# Altium project QuadrotorExpansion.PrjPCB
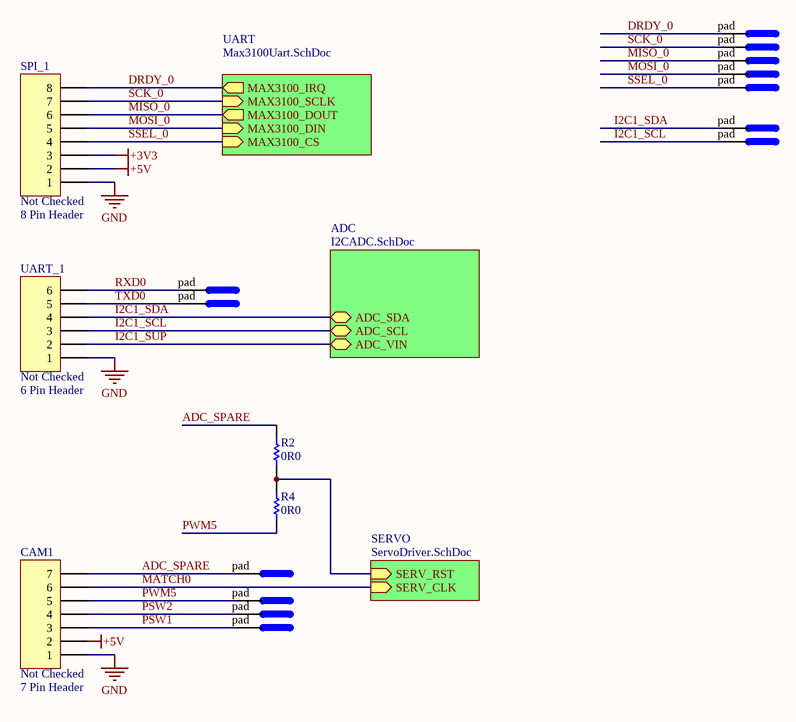
[diagram p0: ExpansionMain.SchDoc]
4 sheets, 65 parts. Net scope: hierarchical (ports join the sheet entries above them; power ports are global).
Board file: PCB5.PcbDoc
Sheets:
  ExpansionMain.SchDoc
    SERVO = ServoDriver.SchDoc
    UART = Max3100Uart.SchDoc
    ADC = I2CADC.SchDoc

## Sheet ExpansionMain.SchDoc
size A; PageSetup: Record=PageOptions|CenterHorizontal=True|CenterVertical=True|PrintScale=1.54|XCorrection=1.00|YCorrection=1.00|PrintKind=1|BorderSize=5000000|LeftOffset=0|BottomOffset=0|Orientation=2|PaperLength=1000|PaperWidth=1000|Scale=100|PaperSource=7|PrintQuality=-4|MediaType=1|DitherType=10|PaperKind=A3|PrintScaleMode=1

### Parts
A0  (no value)  [PAD_ROUND]
CAM1  Verify: Not Checked  [CONN_7X1_SMT_RA_1.25MM]  (hidden comment: 7 Pin Header)
DRDY  (no value)  [PAD_ROUND]
MISO  (no value)  [PAD_ROUND]
MOSI  (no value)  [PAD_ROUND]
PWM  (no value)  [PAD_ROUND]
R2  0R0  [0805]  (no BOM)
R4  0R0  [0805]  (no BOM)
RX0  (no value)  [PAD_ROUND]
SCK  (no value)  [PAD_ROUND]
SCL  (no value)  [PAD_ROUND]
SDA  (no value)  [PAD_ROUND]
SPI_1  Verify: Not Checked  [CONN_8X1_SMT_RA_1.25MM]  (hidden comment: 8 Pin Header)
SSEL  (no value)  [PAD_ROUND]
SW1  (no value)  [PAD_ROUND]
SW2  (no value)  [PAD_ROUND]
TX0  (no value)  [PAD_ROUND]
UART_1  Verify: Not Checked  [CONN_6X1_SMT_RA_1.25MM]  (hidden comment: 6 Pin Header)

### Sub-sheets
ADC = I2CADC.SchDoc: ADC_SCL (bidir), ADC_SDA (bidir), ADC_VIN (bidir)
SERVO = ServoDriver.SchDoc: SERV_CLK (in), SERV_RST (in)
UART = Max3100Uart.SchDoc: MAX3100_DIN (in), MAX3100_CS (in), MAX3100_DOUT (out), MAX3100_SCLK (in), MAX3100_IRQ (out)

### Nets
+3V3: SPI_1.3
+5V: CAM1.2 SPI_1.2
GND: CAM1.1 SPI_1.1 UART_1.1
I2C1_SUP: UART_1.2 ; sheet ADC/ADC_VIN
ADC_SPARE: A0.pad CAM1.7 R2.1
DRDY_0: DRDY.pad SPI_1.8 ; sheet UART/MAX3100_IRQ
I2C1_SCL: SCL.pad UART_1.3 ; sheet ADC/ADC_SCL
I2C1_SDA: SDA.pad UART_1.4 ; sheet ADC/ADC_SDA
MATCH0: CAM1.6 ; sheet SERVO/SERV_CLK
MISO_0: MISO.pad SPI_1.6 ; sheet UART/MAX3100_DOUT
MOSI_0: MOSI.pad SPI_1.5 ; sheet UART/MAX3100_DIN
PSW1: CAM1.3 SW1.pad
PSW2: CAM1.4 SW2.pad
PWM5: CAM1.5 PWM.pad R4.2
RXD0: RX0.pad UART_1.6
SCK_0: SCK.pad SPI_1.7 ; sheet UART/MAX3100_SCLK
SSEL_0: SPI_1.4 SSEL.pad ; sheet UART/MAX3100_CS
TXD0: TX0.pad UART_1.5
NetR2_2: R2.2 R4.1 ; sheet SERVO/SERV_RST

### Library data of the parts
A0 DRDY MISO MOSI PWM RX0 SCK SCL SDA SSEL SW1 SW2 TX0 = JP_pad: Pad; pin to pad: pad>1
CAM1 = JP_7PIN HDR_SMT_RA_MOLEX: CONN HDR VERT 7POS .100" SNGL; Manufacturer: Molex; Manufacturer PN: 53261-0771; Prototype: Digikey WM7626CT-ND; LatestRevisionDate: 24 Jun 08; Value: 7 Pin Header
R2 R4 = RS_0R0 0603: RES 0.0 OHM 1/10W 5% 0603 SMD; Manufacturer: Rohm; Manufacturer PN: MCR03EZPJ000; Prototype: DigiKey RHM0.0GCT-ND; LatestRevisionDate: 3 Jun 08; Value: 0R0
SPI_1 = JP_8PIN HDR_SMT_RA_MOLEX: CONN HDR VERT 12POS .100" SNGL; Manufacturer: Molex; Manufacturer PN: 53261-0871; Prototype: Digikey WM7626CT-ND; LatestRevisionDate: 24 Jun 08; Value: 8 Pin Header
UART_1 = JP_6PIN HDR_SMT_RA_MOLEX: CONN HDR VERT 6POS .100" SNGL; Manufacturer: Molex; Manufacturer PN: 53261-0671; Prototype: Digikey WM7624CT-ND; LatestRevisionDate: 24 Jun 08; Value: 6 Pin Header

## Sheet ServoDriver.SchDoc
size A; PageSetup: Record=PageOptions|CenterHorizontal=True|CenterVertical=True|PrintScale=1.00|XCorrection=1.00|YCorrection=1.00|PrintKind=1|BorderSize=5000000|LeftOffset=0|BottomOffset=0|Orientation=2|PaperLength=1000|PaperWidth=1000|Scale=100|PaperSource=7|PrintQuality=-4|MediaType=1|DitherType=10|PaperKind=A4|PrintScaleMode=1
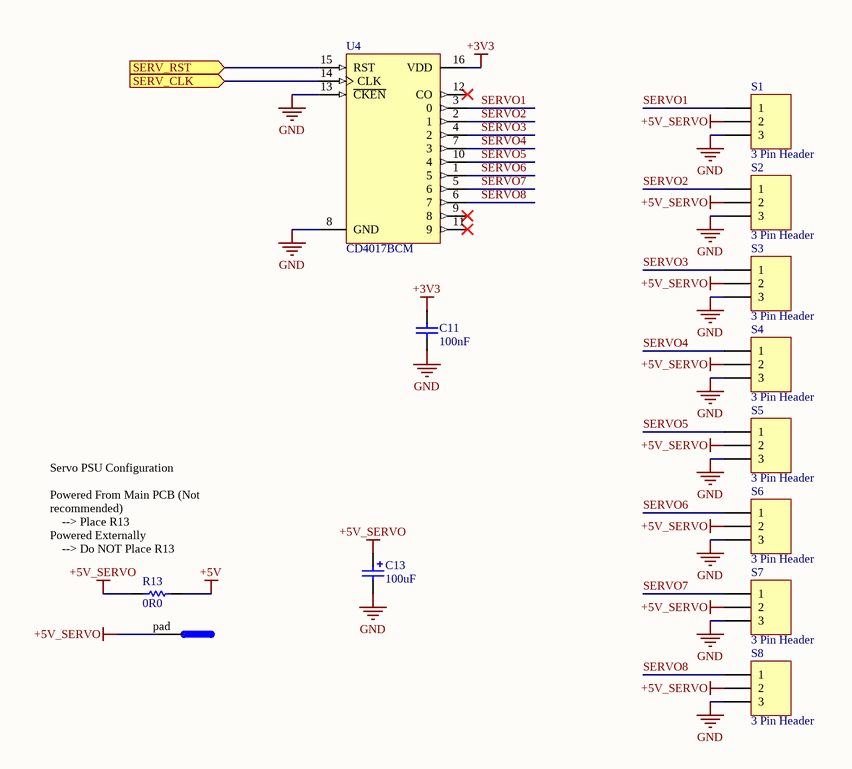
[diagram p1: ServoDriver.SchDoc]

### Parts
C11  100nF  [0603]
C13  value 100uF  [CAP_ELECTRO_6.3x11]  (hidden comment: CP_POL_100uF_25V_6.3mm)
PS  (no value)  [PAD_ROUND]
R13  0R0  [0805]  (no BOM)
S1  3 Pin Header  [G_HDR1X3_RND_PIN1_NO_OVERLAY]
S2  3 Pin Header  [G_HDR1X3_RND_PIN1_NO_OVERLAY]
S3  3 Pin Header  [G_HDR1X3_RND_PIN1_NO_OVERLAY]
S4  3 Pin Header  [G_HDR1X3_RND_PIN1_NO_OVERLAY]
S5  3 Pin Header  [G_HDR1X3_RND_PIN1_NO_OVERLAY]
S6  3 Pin Header  [G_HDR1X3_RND_PIN1_NO_OVERLAY]
S7  3 Pin Header  [G_HDR1X3_RND_PIN1_NO_OVERLAY]
S8  3 Pin Header  [G_HDR1X3_RND_PIN1_NO_OVERLAY]
U4  CD4017BCM  [PW016]

### Ports
SERV_CLK (in), SERV_RST (in)

### Nets
+3V3: C11.2 U4.16(VDD)
+5V: R13.1
+5V_SERVO: C13.1 PS.pad R13.2 S1.2 S2.2 S3.2 S4.2 S5.2 S6.2 S7.2 S8.2
GND: C11.1 C13.2 S1.3 S2.3 S3.3 S4.3 S5.3 S6.3 S7.3 S8.3 U4.8(GND) U4.13(~{CKEN})
MATCH0: U4.14(CLK) ; port SERV_CLK
SERVO1: S1.1 U4.3(0)
SERVO2: S2.1 U4.2(1)
SERVO3: S3.1 U4.4(2)
SERVO4: S4.1 U4.7(3)
SERVO5: S5.1 U4.10(4)
SERVO6: S6.1 U4.1(5)
SERVO7: S7.1 U4.5(6)
SERVO8: S8.1 U4.6(7)
NetR2_2: U4.15(RST) ; port SERV_RST

Not connected (* = marked no-connect by the designer): U4 9(8)* 11(9)* 12(CO)*

### Notes on the sheet
- (near R13) Servo PSU Configuration
  Powered From Main PCB (Not recommended)
  --> Place R13
  Powered Externally
  --> Do NOT Place R13

### Library data of the parts
C11 = CP_100nF 0603: CAP CER .10UF 50V X5R 0603; Manufacturer: Taiyo Yuden; Manufacturer PN: UMK107B7104KA-T; Prototype: Digikey 587-1243-1-ND; LatestRevisionDate: 29 May 08; Value: 100nF
C13 = CP_POL_100uF_25V_6.3mm: Polarized Capacitor (Radial); Manufacturer: Multicomp; Manufacturer PN: MCGPR25V107M6.3X11-RH; Prototype: Digikey P833-ND; LatestRevisionDate: 7 Janurary 09
PS = JP_pad: Pad; pin to pad: pad>1
R13 = RS_0R0 0603: RES 0.0 OHM 1/10W 5% 1206 SMD; Manufacturer: Rohm; Manufacturer PN: MCR03EZPJ000; Prototype: DigiKey P0.0ECT-ND; LatestRevisionDate: 3 Jun 08; Value: 0R0
S1-S8 = JP_3PIN HDR: CONN HDR VERT 3POS .100" SNGL; LatestRevisionDate: 24 Jun 08; Value: 3 Pin Header
U4 = CD4017BCM: Decade Counter/Divider with 10 Decoded Outputs; Published: 17-Jul-2002; LatestRevisionDate: 13-Apr-2006; LatestRevisionNote: IPC-7351 Footprint Added.; DatasheetVersion: Jan-1999; PackageVersion: 2000; PackageReference: M16A; Publisher: Altium Limited; PackageDescription: 16-Pin Small Outline Integrated Circuit 1.27 mm Pitch; Code_IPC: SOIC127P600-16; ComponentLink1Description: Manufacturer Link; ComponentLink1URL: http://www.fairchildsemi.com/; ComponentLink2Description: Datasheet; ComponentLink2URL: http://www.fairchildsemi.com/ds/CD%2FCD4017BC.pdf

## Sheet Max3100Uart.SchDoc
size A; PageSetup: Record=PageOptions|CenterHorizontal=True|CenterVertical=True|PrintScale=1.00|XCorrection=1.00|YCorrection=1.00|PrintKind=1|BorderSize=5000000|LeftOffset=0|BottomOffset=0|Orientation=2|PaperLength=1000|PaperWidth=1000|Scale=100|PaperSource=7|PrintQuality=-4|MediaType=1|DitherType=10|PaperKind=A4|PrintScaleMode=1
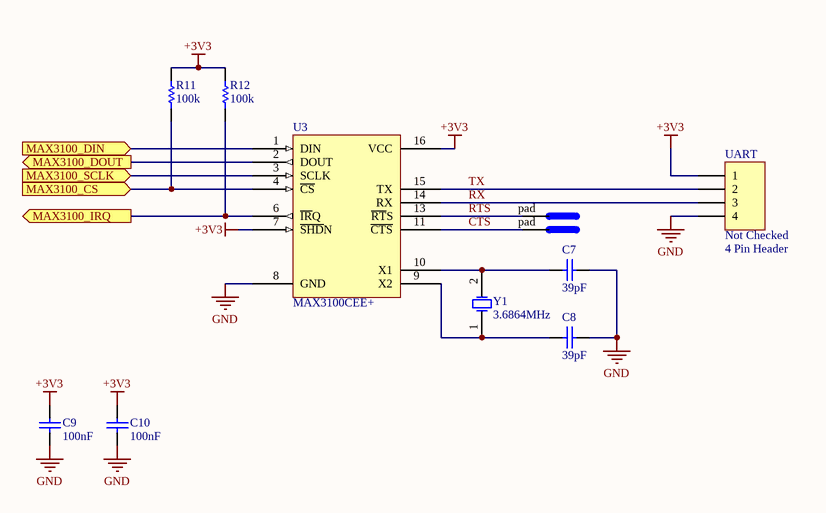
[diagram p2: Max3100Uart.SchDoc]

### Parts
C7  value 39pF  [0603]  (hidden comment: Cap)
C8  value 39pF  [0603]  (hidden comment: Cap)
C9  100nF  [0603]
C10  100nF  [0603]
CTS  (no value)  [PAD_ROUND]
R11  100k  [0603]
R12  100k  [0603]
RTS  (no value)  [PAD_ROUND]
U3  MAX3100CEE+  [QSOP16_MAX3100]
UART  Verify: Not Checked  [CONN_4X1_SMT_RA_1.25MM]  (hidden comment: 4 Pin Header)
Y1  3.6864MHz  [HC49/4h_SMX]

### Ports
MAX3100_CS (in), MAX3100_DIN (in), MAX3100_DOUT (out), MAX3100_IRQ (out), MAX3100_SCLK (in)

### Nets
+3V3: C9.2 C10.2 R11.2 R12.2 U3.7(~{SHD}N) U3.16(VCC) UART.1
GND: C7.2 C8.1 C9.1 C10.1 U3.8(GND) UART.4
CTS: CTS.pad U3.11(~{CTS})
DRDY_0: R12.1 U3.6(~{IR}Q) ; port MAX3100_IRQ
MISO_0: U3.2(DOUT) ; port MAX3100_DOUT
MOSI_0: U3.1(DIN) ; port MAX3100_DIN
RTS: RTS.pad U3.13(~{RT}S)
RX: U3.14(RX) UART.3
SCK_0: U3.3(SCLK) ; port MAX3100_SCLK
SSEL_0: R11.1 U3.4(~{CS}) ; port MAX3100_CS
TX: U3.15(TX) UART.2
NetC7_1: C7.1 U3.10(X1) Y1.2(OSC2)
NetC8_2: C8.2 U3.9(X2) Y1.1(OSC1)

### Library data of the parts
C7 C8 = Cap: Capacitor; Published: 8-Jun-2000; LatestRevisionDate: 17-Jul-2002; LatestRevisionNote: Re-released for DXP Platform.; PackageReference: RAD-0.3; Publisher: Altium Limited
C9 C10 = CP_100nF 0603: as C11 on sheet ServoDriver; LatestRevisionDate: 29 May 08; Value: 100nF
CTS RTS = JP_pad: Pad; pin to pad: pad>1
R11 R12 = RS_100k 0603: RES 100K OHM 1/10W 1% 0603 SMD; Manufacturer: Yageo; Manufacturer PN: RC0603FR-07100KL; Prototype: DigiKey 311-100KHRCT-ND; LatestRevisionDate: 1 Jun 08; Value: 100k
U3 = IC_MAX3100: SPI UART
UART = JP_4PIN HDR_SMT_RA_MOLEX_1: CONN HDR VERT 4POS .100" SNGL; Manufacturer: Molex; Manufacturer PN: 53261-0471; Prototype: Digikey WM7622CT-ND; LatestRevisionDate: 24 Jun 08; Value: 4 Pin Header
Y1 = XTAL: Crystal Oscillator; Manufacturer PN: ECS-36-20-5P; Manufacturer: ECS; Prototype: Digikey, XC562CT-ND; Published: 8-Jun-2000; LatestRevisionDate: 17-Jul-2002; LatestRevisionNote: Re-released for DXP Platform.; PackageReference: R38; Publisher: Altium Limited

## Sheet I2CADC.SchDoc
size A; PageSetup: Record=PageOptions|CenterHorizontal=True|CenterVertical=True|PrintScale=1.09|XCorrection=1.00|YCorrection=1.00|PrintKind=1|BorderSize=5000000|LeftOffset=0|BottomOffset=0|Orientation=2|PaperLength=1000|PaperWidth=1000|Scale=100|PaperSource=7|PrintQuality=-4|MediaType=1|DitherType=10|PaperKind=A4|PrintScaleMode=1
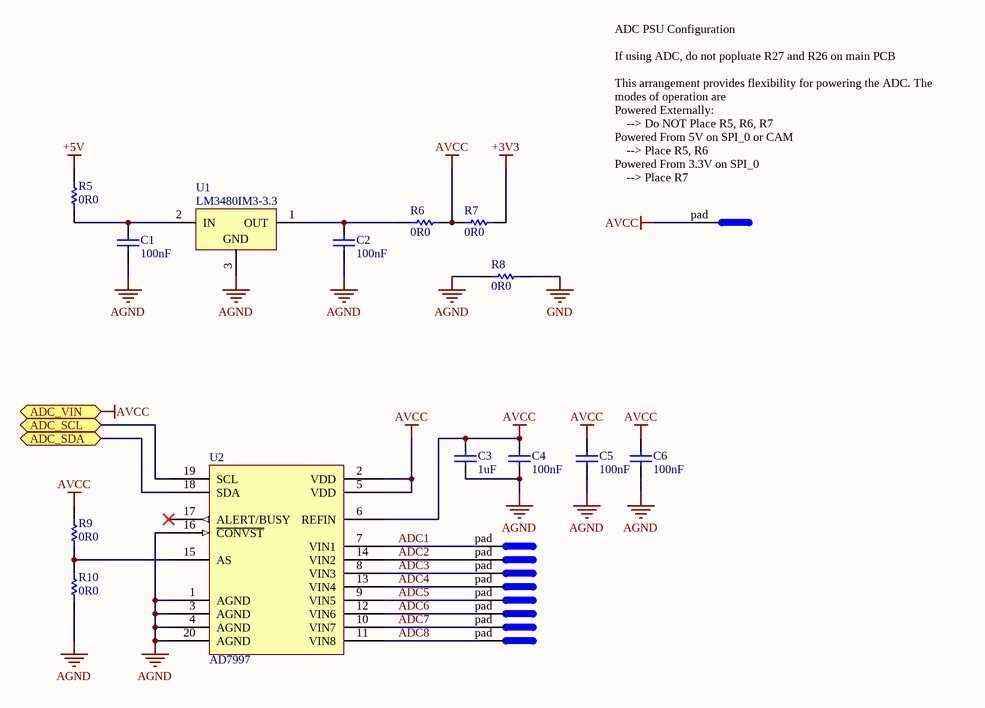
[diagram p3: I2CADC.SchDoc]

### Parts
A1  (no value)  [PAD_ROUND]
A2  (no value)  [PAD_ROUND]
A3  (no value)  [PAD_ROUND]
A4  (no value)  [PAD_ROUND]
A5  (no value)  [PAD_ROUND]
A6  (no value)  [PAD_ROUND]
A7  (no value)  [PAD_ROUND]
A8  (no value)  [PAD_ROUND]
A+  (no value)  [PAD_ROUND]
C1  100nF  [0603]
C2  100nF  [0603]
C3  1uF  [0603]
C4  100nF  [0603]
C5  100nF  [0603]
C6  100nF  [0603]
R5  0R0  [0805]  (no BOM)
R6  0R0  [0805]  (no BOM)
R7  0R0  [0805]  (no BOM)
R8  0R0  [0805]  (no BOM)
R9  0R0  [0805]  (no BOM)
R10  0R0  [0805]  (no BOM)
U1  LM3480IM3-3.3  [MF03A_N]
U2  AD7997  [TSOP65P640-20AM]

### Ports
ADC_SCL (bidir), ADC_SDA (bidir), ADC_VIN

### Nets
+3V3: R7.1
+5V: R5.2
AGND: C1.1 C2.1 C3.1 C4.1 C5.1 C6.1 R8.1 R10.2 U1.3(GND) U2.1(AGND) U2.3(AGND) U2.4(AGND) U2.16(~{CONVST}) U2.20(AGND)
AVCC: A+.pad C3.2 C4.2 C5.2 C6.2 R6.1 R7.2 R9.2 U2.2(VDD) U2.5(VDD) U2.6(REFIN) ; port ADC_VIN  [project net I2C1_SUP]
GND: R8.2
ADC1: A1.pad U2.7(VIN1)
ADC2: A2.pad U2.14(VIN2)
ADC3: A3.pad U2.8(VIN3)
ADC4: A4.pad U2.13(VIN4)
ADC5: A5.pad U2.9(VIN5)
ADC6: A6.pad U2.12(VIN6)
ADC7: A7.pad U2.10(VIN7)
ADC8: A8.pad U2.11(VIN8)
I2C1_SCL: U2.19(SCL) ; port ADC_SCL
I2C1_SDA: U2.18(SDA) ; port ADC_SDA
NetC1_2: C1.2 R5.1 U1.2(IN)
NetC2_2: C2.2 R6.2 U1.1(OUT)
NetR9_1: R9.1 R10.1 U2.15(AS)

Not connected (* = marked no-connect by the designer): U2 17(ALERT/BUSY)*

### Notes on the sheet
- (near A+) ADC PSU Configuration
  If using ADC, do not popluate R27 and R26 on main PCB
  This arrangement provides flexibility for powering the ADC. The modes of operation are
  Powered Externally:
  --> Do NOT Place R5, R6, R7
  Powered From 5V on SPI_0 or CAM
  --> Place R5, R6
  Powered From 3.3V on SPI_0
  --> Place R7

### Library data of the parts
A1-A8 A+ = JP_pad: Pad; pin to pad: pad>1
C1 C2 C4-C6 = CP_100nF 0603: as C11 on sheet ServoDriver; LatestRevisionDate: 29 May 08; Value: 100nF
C3 = CP_1uF 0603: CAP CER 1.0UF 50V X5S 0603; Manufacturer: Taiyo Yuden; Manufacturer PN: UMK107C5105KA-T; Prototype: Digikey 587-1992-1-ND; Value: 1uF
R5-R8 = RS_0R0 0603: as R13 on sheet ServoDriver; LatestRevisionDate: 3 Jun 08; Value: 0R0
R9 R10 = RS_0R0 0603: as R2 on sheet ExpansionMain; LatestRevisionDate: 3 Jun 08; Value: 0R0
U1 = LM3480IM3-3.3: 100 mA, SOT-23, Quasi Low-Dropout Linear Voltage Regulator; Manufacturer: National Semiconductor; CompType: LDO IC; PackageTopMarking: L0A*XTT; Published: 4-Dec-2008; DatasheetVersion: Mar-2005; PackageVersion: revB, Mar-2003; PackageReference: MF03A; Publisher: Altium Limited; PackageDescription: Molded SOT-23, .115 x .051 x .037in Body, 3 Lead, .075 in Pitch; PartNumber: LM3480IM3-3.3; RoHS: O; PinCount: 3; DigiKeyPartNumber: LM3480IM3-3.3CT-ND; ComponentLink1Description: LM3480 Datasheet; ComponentLink1URL: http://www.national.com/ds/LM/LM3480.pdf; ComponentLink2Description: LM3480 Web Page; ComponentLink2URL: http://www.national.com/pf/LM/LM3480.html; ComponentLink3Description: MF03A Package Page; ComponentLink3URL: http://www.national.com/packaging/folders/mf03a.html
U2 = IC_AD7997: 10-bit 8 channel ADC

## Nets that join several sheets
+3V3: ExpansionMain (SPI_1.3), ServoDriver (C11.2 U4.16), Max3100Uart (7 pins), I2CADC (R7.1)
+5V: ExpansionMain (CAM1.2 SPI_1.2), ServoDriver (R13.1), I2CADC (R5.2)
GND: ExpansionMain (CAM1.1 SPI_1.1 UART_1.1), ServoDriver (12 pins), Max3100Uart (6 pins), I2CADC (R8.2)
I2C1_SUP: ExpansionMain (UART_1.2), I2CADC (11 pins)
DRDY_0: ExpansionMain (DRDY.pad SPI_1.8), Max3100Uart (R12.1 U3.6)
I2C1_SCL: ExpansionMain (SCL.pad UART_1.3), I2CADC (U2.19)
I2C1_SDA: ExpansionMain (SDA.pad UART_1.4), I2CADC (U2.18)
MATCH0: ExpansionMain (CAM1.6), ServoDriver (U4.14)
MISO_0: ExpansionMain (MISO.pad SPI_1.6), Max3100Uart (U3.2)
MOSI_0: ExpansionMain (MOSI.pad SPI_1.5), Max3100Uart (U3.1)
NetR2_2: ExpansionMain (R2.2 R4.1), ServoDriver (U4.15)
SCK_0: ExpansionMain (SCK.pad SPI_1.7), Max3100Uart (U3.3)
SSEL_0: ExpansionMain (SPI_1.4 SSEL.pad), Max3100Uart (R11.1 U3.4)